# Altium schematic sheet MCU IOs.SchDoc: MCU IOs
size A4; SheetNumber: 5; SheetTotal: 6
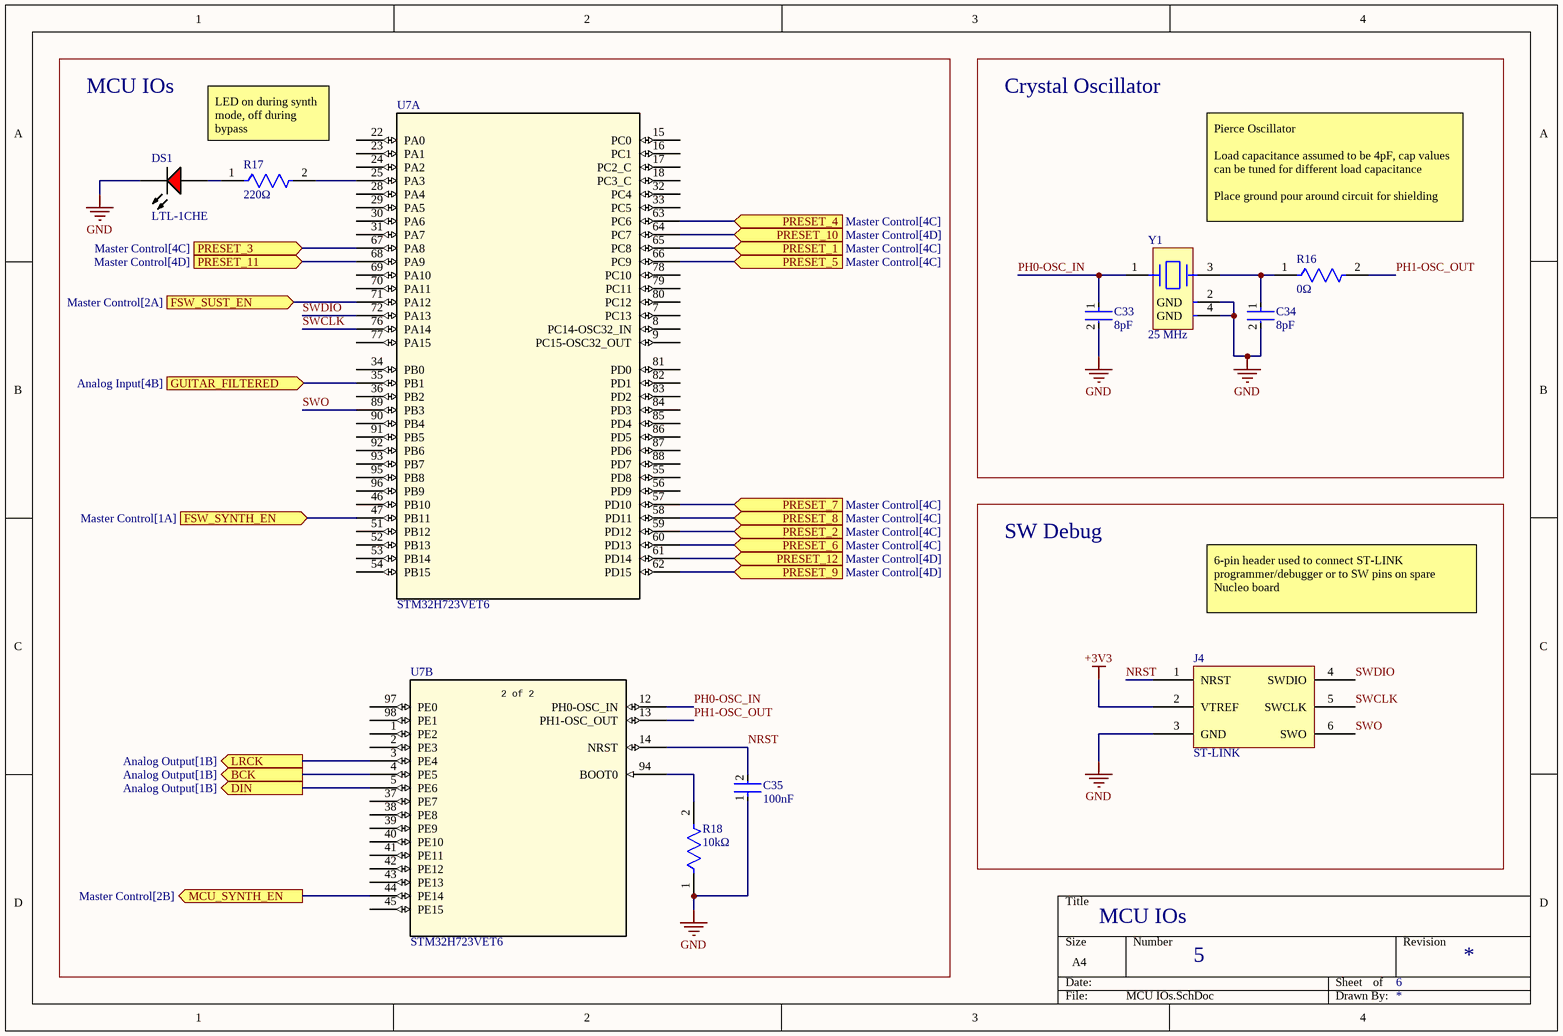
[diagram p0: MCU IOs.SchDoc]

## Parts
C33  8pF  [FP-CBR06C-MFG]
C34  8pF  [FP-CBR06C-MFG]
C35  100nF  [FP-CC0603-DA-MFG]
DS1  LTL-1CHE  [INDPR60-254-520X380X650]
J4  ST-LINK  [STLINK_Header]
R16  0Ω  [FP-CRCW0603-C-MFG]
R17  220Ω  [FP-RT0603-MFG]
R18  10kΩ  [FP-AT0603-MFG]
U7  STM32H723VET6  [LQFP100_STM]  (parts A,B of 3)
Y1  25 MHz  [ABM8W_MFG]

## Blocks framed on the sheet
MCU IOs: C35 DS1 R17 R18 U7
Crystal Oscillator: C33 C34 R16 Y1
SW Debug: J4

## Ports
BCK (out, see Analog Output[1B]), DIN (out, see Analog Output[1B]), FSW_SUST_EN (in, see Master Control[2A]), FSW_SYNTH_EN (in, see Master Control[1A]), GUITAR_FILTERED (in, see Analog Input[4B]), LRCK (out, see Analog Output[1B]), MCU_SYNTH_EN (out, see Master Control[2B]), PRESET_1 (in, see Master Control[4C]), PRESET_2 (in, see Master Control[4C]), PRESET_3 (in, see Master Control[4C]), PRESET_4 (in, see Master Control[4C]), PRESET_5 (in, see Master Control[4C]), PRESET_6 (in, see Master Control[4C]), PRESET_7 (in, see Master Control[4C]), PRESET_8 (in, see Master Control[4C]), PRESET_9 (in, see Master Control[4D]), PRESET_10 (in, see Master Control[4D]), PRESET_11 (in, see Master Control[4D]), PRESET_12 (in, see Master Control[4D])

## Nets
+3V3: J4.2(VTREF)
GND: C33.2 C34.2 C35.1 DS1.2(K) J4.3(GND) R18.1 Y1.2(GND) Y1.4(GND)
BCK: U7.4(PE5) ; port BCK
DIN: U7.5(PE6) ; port DIN
FSW_SUST_EN: U7.71(PA12) ; port FSW_SUST_EN
FSW_SYNTH_EN: U7.47(PB11) ; port FSW_SYNTH_EN
GUITAR_FILTERED: U7.35(PB1) ; port GUITAR_FILTERED
LRCK: U7.3(PE4) ; port LRCK
MCU_SYNTH_EN: U7.44(PE14) ; port MCU_SYNTH_EN
NRST: C35.2 J4.1(NRST) U7.14(NRST)
PH0-OSC_IN: C33.1 U7.12(PH0-OSC_IN) Y1.1
PH1-OSC_OUT: R16.2 U7.13(PH1-OSC_OUT)
PRESET_1: U7.65(PC8) ; port PRESET_1
PRESET_2: U7.59(PD12) ; port PRESET_2
PRESET_3: U7.67(PA8) ; port PRESET_3
PRESET_4: U7.63(PC6) ; port PRESET_4
PRESET_5: U7.66(PC9) ; port PRESET_5
PRESET_6: U7.60(PD13) ; port PRESET_6
PRESET_7: U7.57(PD10) ; port PRESET_7
PRESET_8: U7.58(PD11) ; port PRESET_8
PRESET_9: U7.62(PD15) ; port PRESET_9
PRESET_10: U7.64(PC7) ; port PRESET_10
PRESET_11: U7.68(PA9) ; port PRESET_11
PRESET_12: U7.61(PD14) ; port PRESET_12
SWCLK: J4.5(SWCLK) U7.76(PA14)
SWDIO: J4.4(SWDIO) U7.72(PA13)
SWO: J4.6(SWO) U7.89(PB3)
NetC34_1: C34.1 R16.1 Y1.3
NetDS1_1: DS1.1(A) R17.1
NetR17_2: R17.2 U7.25(PA3)
NetR18_2: R18.2 U7.94(BOOT0)

Not connected (* = marked no-connect by the designer): U7 1(PE2) 2(PE3) 7(PC13) 8(PC14-OSC32_IN) 9(PC15-OSC32_OUT) 15(PC0) 16(PC1) 17(PC2_C) 18(PC3_C) 22(PA0) 23(PA1) 24(PA2) 28(PA4) 29(PA5) 30(PA6) 31(PA7) 32(PC4) 33(PC5) 34(PB0) 36(PB2) 37(PE7) 38(PE8) 39(PE9) 40(PE10) 41(PE11) 42(PE12) 43(PE13) 45(PE15) 46(PB10) 51(PB12) 52(PB13) 53(PB14) 54(PB15) 55(PD8) 56(PD9) 69(PA10) 70(PA11) 77(PA15) 78(PC10) 79(PC11) 80(PC12) 81(PD0) 82(PD1) 83(PD2) 84(PD3) 85(PD4) 86(PD5) 87(PD6) 88(PD7) 90(PB4) 91(PB5) 92(PB6) 93(PB7) 95(PB8) 96(PB9) 97(PE0) 98(PE1)

## Notes on the sheet
- LED on during synth mode, off during bypass
- Pierce Oscillator
  Load capacitance assumed to be 4pF, cap values can be tuned for different load capacitance
  Place ground pour around circuit for shielding
- 6-pin header used to connect ST-LINK programmer/debugger or to SW pins on spare Nucleo board
- (in symbol STM32H723VET6, part B) 2 of 2

## Library data of the parts
C33 C34 = CMP-03020-000447-1: CAP CER 8PF 100V NP0 0603; Manufacturer: KEMET; Manufacturer Part Number: CBR06C809B1GAC; Capacitance: 8.0 pF; Value: 8.0 pF; Temperature Characteristic: C0G; Temperature Coefficient: 30ppm/°C; Material: Ceramic; Tolerance: 0.1 pF; Device Class L1: Passive Components; Digikey Description: CAP CER 8PF 100V NP0 0603; Ipc Land Pattern Name: CAPC16080X80; Octopart: https://octopart.com/cbr06c809b1gac-kemet-23801742; Device Class L3: Ceramic Capacitors; ComponentLink2Description: Datasheet; Voltage Rating: 100 V; RoHS: TRUE; Temperature Range Low: -55°C; Temperature: -55°C to +125°C; Device Class L2: Capacitors; Height: 0.87mm; Temperature Range High: +125°C; ComponentLink2URL: https://content.kemet.com/datasheets/KEM_C1030_CBR_SMD.pdf; Category: Cap; Automotive: No; Lead Free: Yes; Package: CBR06C
C35 = CMP-03422-000081-1: CC0603 100 nF X7R 10.00% 25 V; Manufacturer Part Number: CC0603KPX7R8BB104; Manufacturer: YAGEO; Voltage: 25 V; Material: Ceramic; Tolerance: 0.1; Temperature Coefficient: 15%; Package: CC0603-DA; Capacitance: 100 nF; Device Class L2: Capacitors; Temperature Range High: +125°C; Automotive: No; Temperature Range Low: -55°C; Value: 100 nF; Device Class L1: Passive Components; Height: 0.9mm; RoHS: TRUE; Mouser Description: Multilayer Ceramic Capacitors MLCC - SMD/SMT 100nF 25V X7R 10%; Temperature Characteristic: X7R; Footprint Url: http://www.yageo.com/exep/pages/download/literatures/UPY-C_GEN_24.pdf; Octopart: https://octopart.com/cc0603kpx7r8bb104-yageo-12885111; Category: Cap; ComponentLink2Description: Datasheet; Voltage Rating: 25 V; Temperature: -55°C to +125°C; Device Class L3: Ceramic Capacitors; ComponentLink2URL: http://www.yageo.com/documents/recent/UPY-GPHC_X7R_6.3V-to-50V_18.pdf; Lead Free: Yes
DS1 = CMP-1674-00005-1: Radial LED, 12.6 mcd, 20 mA, 2 V, -55 to 100 degC, 2-Pin THD, RoHS, Bulk; Shielding: Unshielded; Resistance: 0.045 Ohm; Current Rating: 3.6 A; Tolerance: 20%; PackageReference: LTL-1CHE; PackageDescription: 2-Pin Through Hole Device, Dia 3.8 mm, Pitch 2.54 mm; Case\Package: Radial; Length: 0.97 inch; Width: 0.62 inch; Height: 1.1 inch; Radiation Hardening: No; Lead Pitch: 11.44 mm; ComponentLink1URL: http://www.us.liteon.com/; ComponentLink1Description: Manufacturer URL; RoHSCompliant: true; Packaging: Tray; Mount: Through Hole; Min Operating Temperature: -40 degC; Max Operating Temperature: 130 degC; ComponentLink2URL: https://datasheet.ciiva.com/15117/getdatasheetpartid-187746-15117985.pdf; Package Quantity: 55; ComponentLink2Description: Datasheet; DatasheetVersion: Dec-03
R16 = CMP-02407-011552-1: RES 0 OHM JUMPER 1/10W 0603; Max Power Dissipation: 100mW; Resistance: 0mR; Min Operating Temperature: -55°C; Packaging: Cut Tape; Resistor Type: Thick Film; RoHS Compliant: Yes; Case/Package: 0603; Case Code (Imperial): 0603; Max Operating Temperature: 155°C; Number of Terminations: 2; Case Code (Metric): 1608
R17 = CMP-2000-04526-2: RES SMD 220 OHM 0.1% 1/10W 0603; Manufacturer: Yageo; Manufacturer Part Number: RT0603BRE07220RL; Temperature Coefficient: 50 ppm/°C; Power Rating: 0.1W; Description: RT0603 220Ω 0.1W 50 ppm/°C 0.10%; Voltage Rating: 75V; Tolerance: 0.001; Temperature Range Low: -55°C; Composition: Thin Film; Value: 220Ω; Ipc Land Pattern Name: RESC16080X45; Lead Free: Yes; Temperature: -55°C to +155°C; Automotive: No; Digikey Description: RES SMD 220 OHM 0.1% 1/10W 0603; Series: RT; Package: RT0603; Resistance: 220Ω; Footprint Url: http://www.yageo.com/exep/pages/download/literatures/PYu-R_Mount_10.pdf; Device Class L1: Passive Components; ComponentLink2URL: http://www.yageo.com/documents/recent/PYu-RT_1-to-0.01_RoHS_L_9.pdf; Category: Res; RoHS: TRUE; ComponentLink2Description: Datasheet; Temperature Range High: +155°C; Device Class L3: Chip SMD Resistors; Device Class L2: Resistors; Octopart: https://octopart.com/rt0603bre07220rl-yageo-1214202; Height: 0.55mm
R18 = CMP-03412-022275-2: Thin Film Chip Resistors Automotive Grade 10kΩ 0.1% 25ppm/°C 0603; Max Power Dissipation: 100mW; Resistance: 10kR; Min Operating Temperature: -55°C; Ratings: AEC-Q200; Case/Package: 0603; Tolerance: 0.1%; Resistor Type: Thin Film; Max Operating Temperature: 155°C; RoHS Compliant: Yes; Length: 0.063inch; Temperature Coefficient: 25ppm/°C; Packaging: Cut Tape; Number of Terminations: 2; Case Code (Metric): 1608; Case Code (Imperial): 0603; Features: Moisture Resistant; Series: AT; Width: 0.032inch; Height: 0.022inch
U7 = STM32H723VET6: High-performance and DSP with DP-FPU, Arm Cortex-M7 MCU with 512 Kbytes Flash, 564 Kbytes RAM, 550 MHz CPU, L1 cache, external memory interface, subset of peripherals; Manufacturer_Name: STMicroelectronics; Copyright: Copyright (C) 2026 Ultra Librarian. All rights reserved.; Manufacturer_Part_Number: STM32H723VET6; RefDes: RefDes; Type: Type
Y1 = CMP-00005-81936285-1: Crystal 25.0000Mhz 8Pf Smd Rohs Compliant: Yes; RoHS: Compliant; ComponentLink2Description: Datasheet URL; Schedule B: 8541600080; ComponentLink2URL: https://abracon.com/datasheets/ABM8W.pdf; HelpURL: https://abracon.com/datasheets/ABM8W.pdf